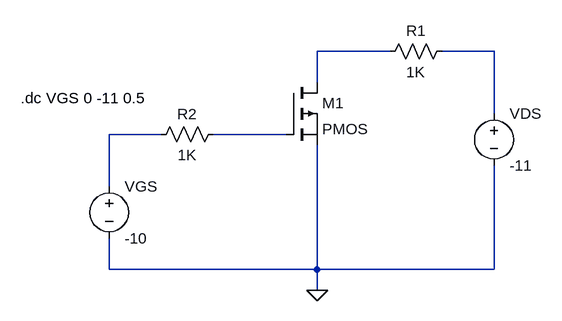
[diagram p0: schematic Transfer Characteristics of E-MOSFET.asc]
Transfer Characteristics of E-MOSFET.asc, the LTspice schematic file:
Version 4
SHEET 1 880 680
WIRE 336 48 224 48
WIRE 496 48 416 48
WIRE 224 96 224 48
WIRE 496 144 496 48
WIRE -16 176 -96 176
WIRE 176 176 64 176
WIRE -96 256 -96 176
WIRE -96 384 -96 336
WIRE 224 384 224 192
WIRE 224 384 -96 384
WIRE 496 384 496 224
WIRE 496 384 224 384
WIRE 224 416 224 384
FLAG 224 416 0
SYMBOL res 432 32 R90
WINDOW 0 0 56 VBottom 2
WINDOW 3 32 56 VTop 2
SYMATTR InstName R1
SYMATTR Value 1K
SYMBOL res 80 160 R90
WINDOW 0 0 56 VBottom 2
WINDOW 3 32 56 VTop 2
SYMATTR InstName R2
SYMATTR Value 1K
SYMBOL voltage -96 240 R0
WINDOW 123 0 0 Left 0
WINDOW 39 0 0 Left 0
SYMATTR InstName VGS
SYMATTR Value -10
SYMBOL voltage 496 128 R0
WINDOW 123 0 0 Left 0
WINDOW 39 0 0 Left 0
SYMATTR InstName VDS
SYMATTR Value -11
SYMBOL pmos 176 96 R0
SYMATTR InstName M1
TEXT -232 120 Left 2 !.dc VGS 0 -11 0.5

The netlist it stands for:
* Transfer Characteristics of E-MOSFET.asc
R1 N002 N001 1K
R2 N004 N003 1K
VGS N003 0 -10
VDS N002 0 -11
M1 N001 N004 0 0 PMOS
.model NMOS NMOS
.model PMOS PMOS
.lib standard.mos
.dc VGS 0 -11 0.5
.backanno
.end